# EAGLE schematic Works_006 (EAGLE 8.2.1)
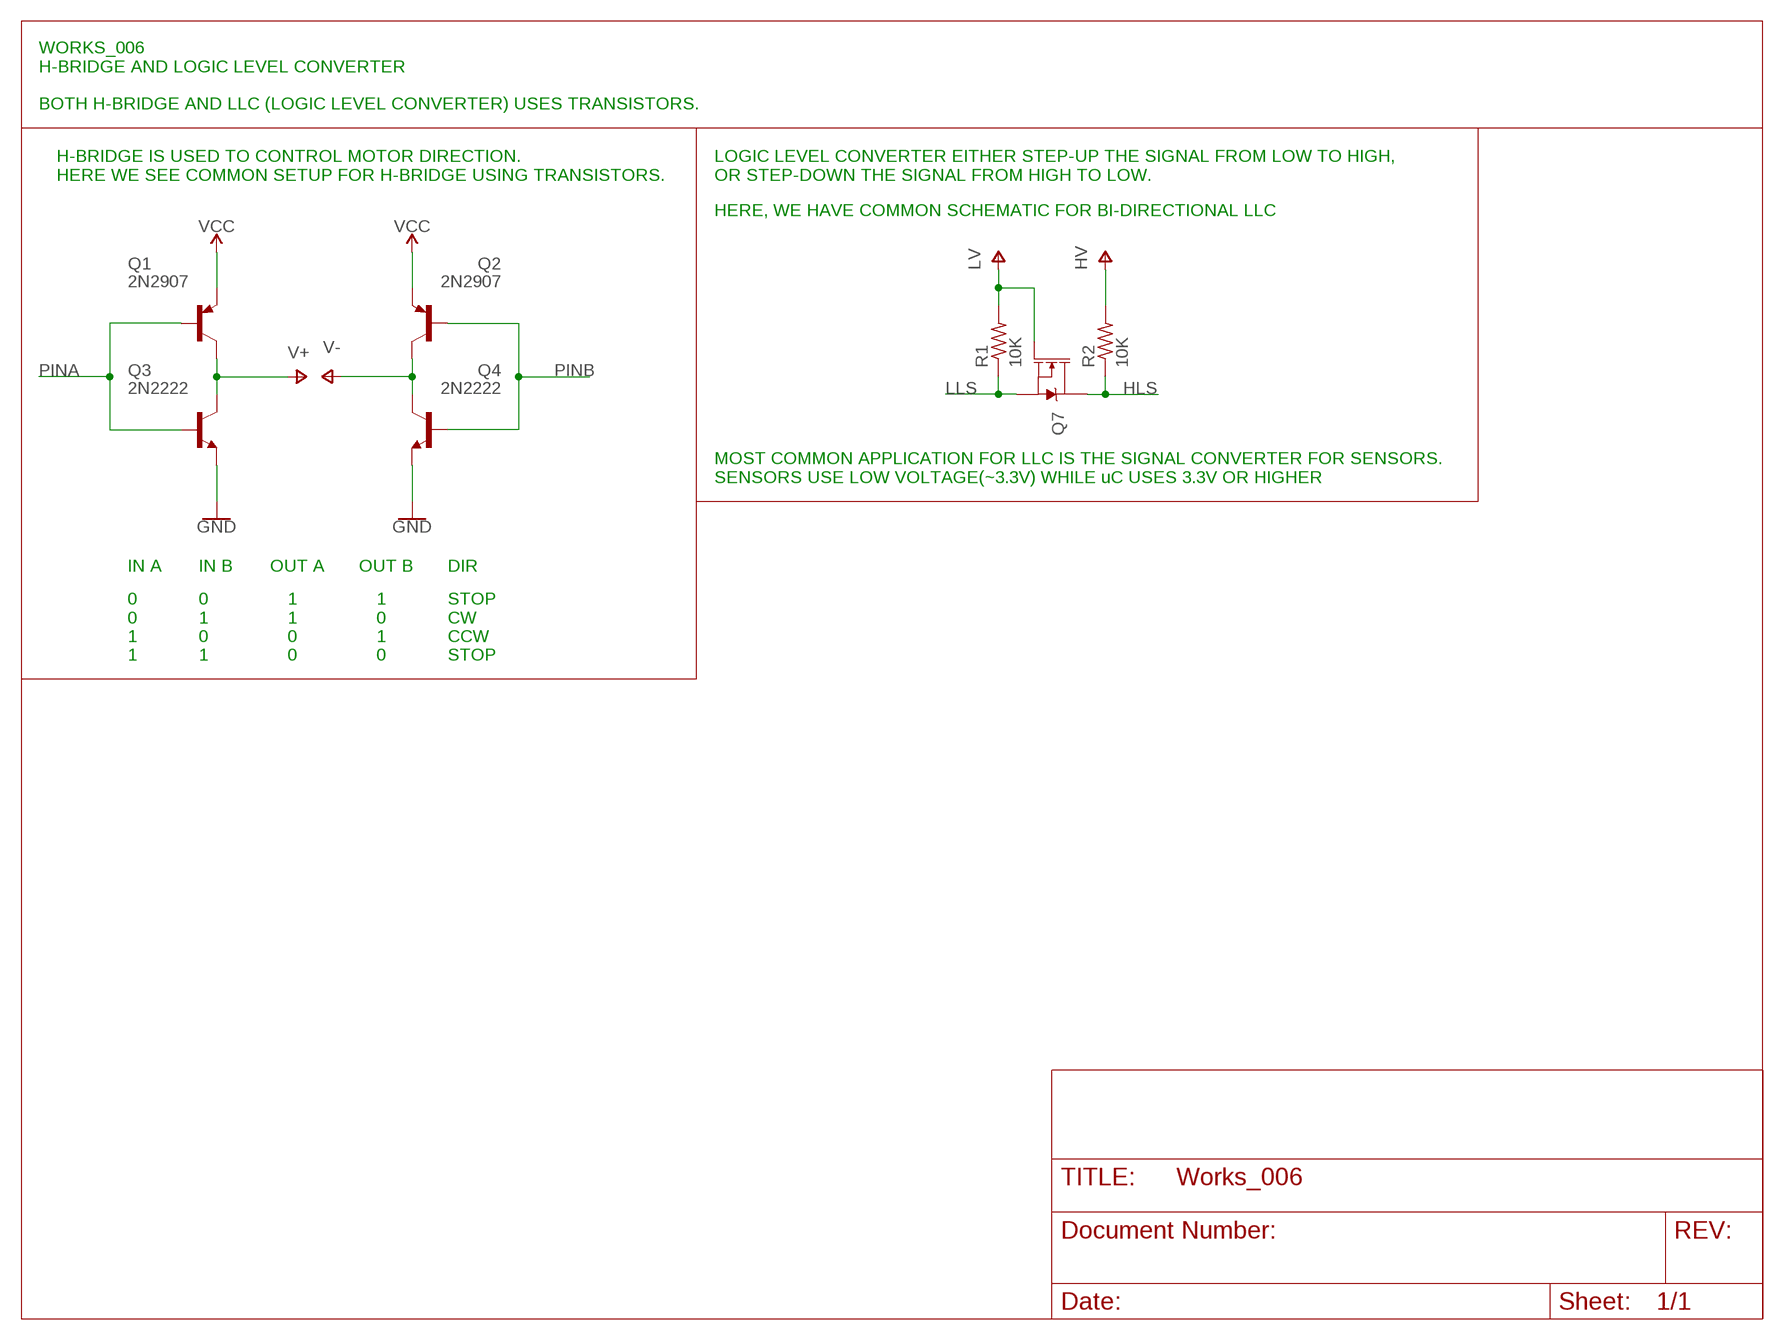
[diagram p0: schematic, sheet 1]

## Parts
Q1  2N2907  [TO92-EBC-OVAL]
Q2  2N2907  [TO92-EBC-OVAL]
Q3  2N2222  [TO92-EBC-OVAL]
Q4  2N2222  [TO92-EBC-OVAL]
Q7  MOSFET-NCH-BSS138  [SOT23-3]
R1  10K  R-US_R0805  [R0805]
R2  10K  R-US_R0805  [R0805]

## Nets
GND: Q3.E Q4.E
HLS: Q7.3(D) R2.1
LLS: Q7.2(S) R1.1
PINA: Q1.B Q3.B
PINB: Q2.B Q4.B
V+: Q1.C Q3.C Q7.1(G) R1.2 R2.2 ; supply symbol labelled LV, HV
V-: Q2.C Q4.C
VCC: Q1.E Q2.E

## Notes on the sheet
- WORKS_006
  H-BRIDGE AND LOGIC LEVEL CONVERTER
  
  BOTH H-BRIDGE AND LLC (LOGIC LEVEL CONVERTER) USES TRANSISTORS.
- H-BRIDGE IS USED TO CONTROL MOTOR DIRECTION.
  HERE WE SEE COMMON SETUP FOR H-BRIDGE USING TRANSISTORS.
- LOGIC LEVEL CONVERTER EITHER STEP-UP THE SIGNAL FROM LOW TO HIGH,
  OR STEP-DOWN THE SIGNAL FROM HIGH TO LOW.
- HERE, WE HAVE COMMON SCHEMATIC FOR BI-DIRECTIONAL LLC
- MOST COMMON APPLICATION FOR LLC IS THE SIGNAL CONVERTER FOR SENSORS.
  SENSORS USE LOW VOLTAGE(~3.3V) WHILE uC USES 3.3V OR HIGHER
- IN A | IN B | OUT A | OUT B | DIR
- 0
  0
  1
  1
- 0
  1
  0
  1
- 1
  1
  0
  0
- 1
  0
  1
  0
- STOP
  CW
  CCW
  STOP

## Library data of the parts
Q1 Q2 = adafruit:2N2907*: PNP Transistor Big Oval pads
Q3 Q4 = adafruit:2N2222: NPN TRANSISTOR Big oval pads
Q7 = SparkFun-DiscreteSemi:MOSFET-NCH: N-channel MOSFETs Voltage controlled devices that allow control of high current outputs. SparkFun Products: SparkFun OpenScale <https://www.sparkfun.com/products/13261> SparkFun Digital Sandbox <https://www.sparkfun.com/products/12651> SparkFun Monster Moto Shield <https://www.sparkfun.com/products/10182> SparkFun MOSFET Power Controller <https://www.sparkfun.com/products/11214>; PROD_ID: TRANS-00830; VALUE: 220mA/50V/3.5Ω
R1 R2 = adafruit:R-US_: RESISTOR, American symbol